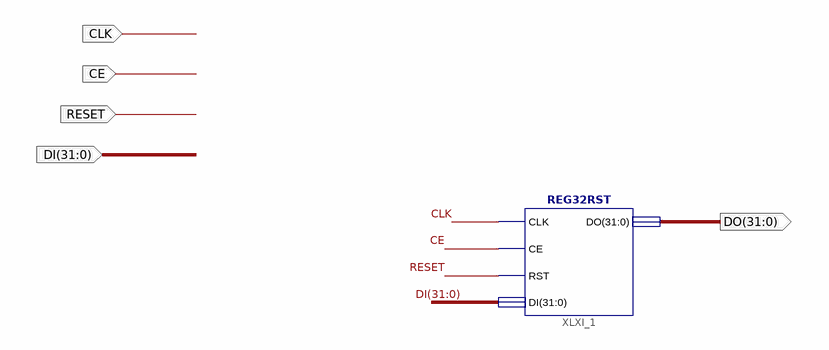
[diagram p0: schematic sheet 1]
// Xilinx ISE schematic REGC.sch (artix7) as structural Verilog: 1 symbols, 5 ports
module REGC (
  input  CLK,
  input  CE,
  input  RESET,
  input  [31:0] DI,
  output [31:0] DO
);

  REG32RST XLXI_1 (.CLK(CLK), .CE(CE), .RST(RESET), .DI(DI), .DO(DO));
endmodule
